# EAGLE schematic CPU board 2 7 (EAGLE 9.3.1)
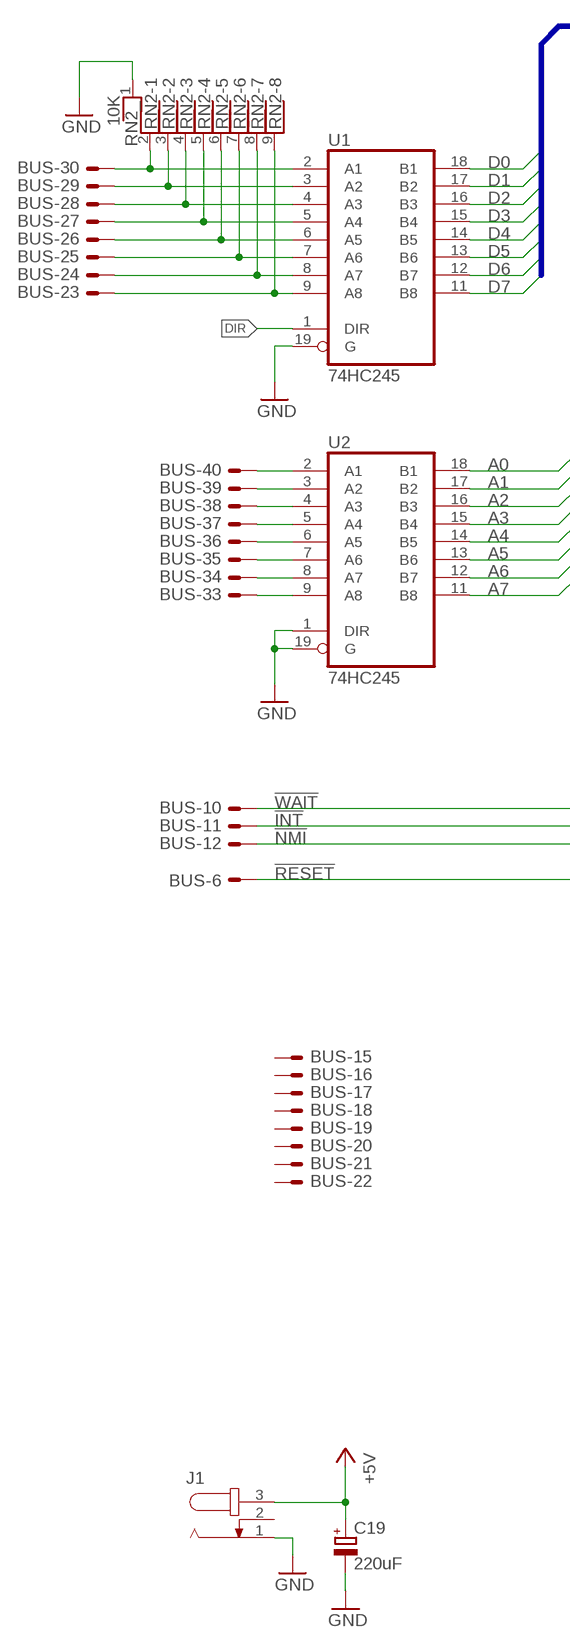
[diagram p0: schematic, sheet 1, part 1 of 2]
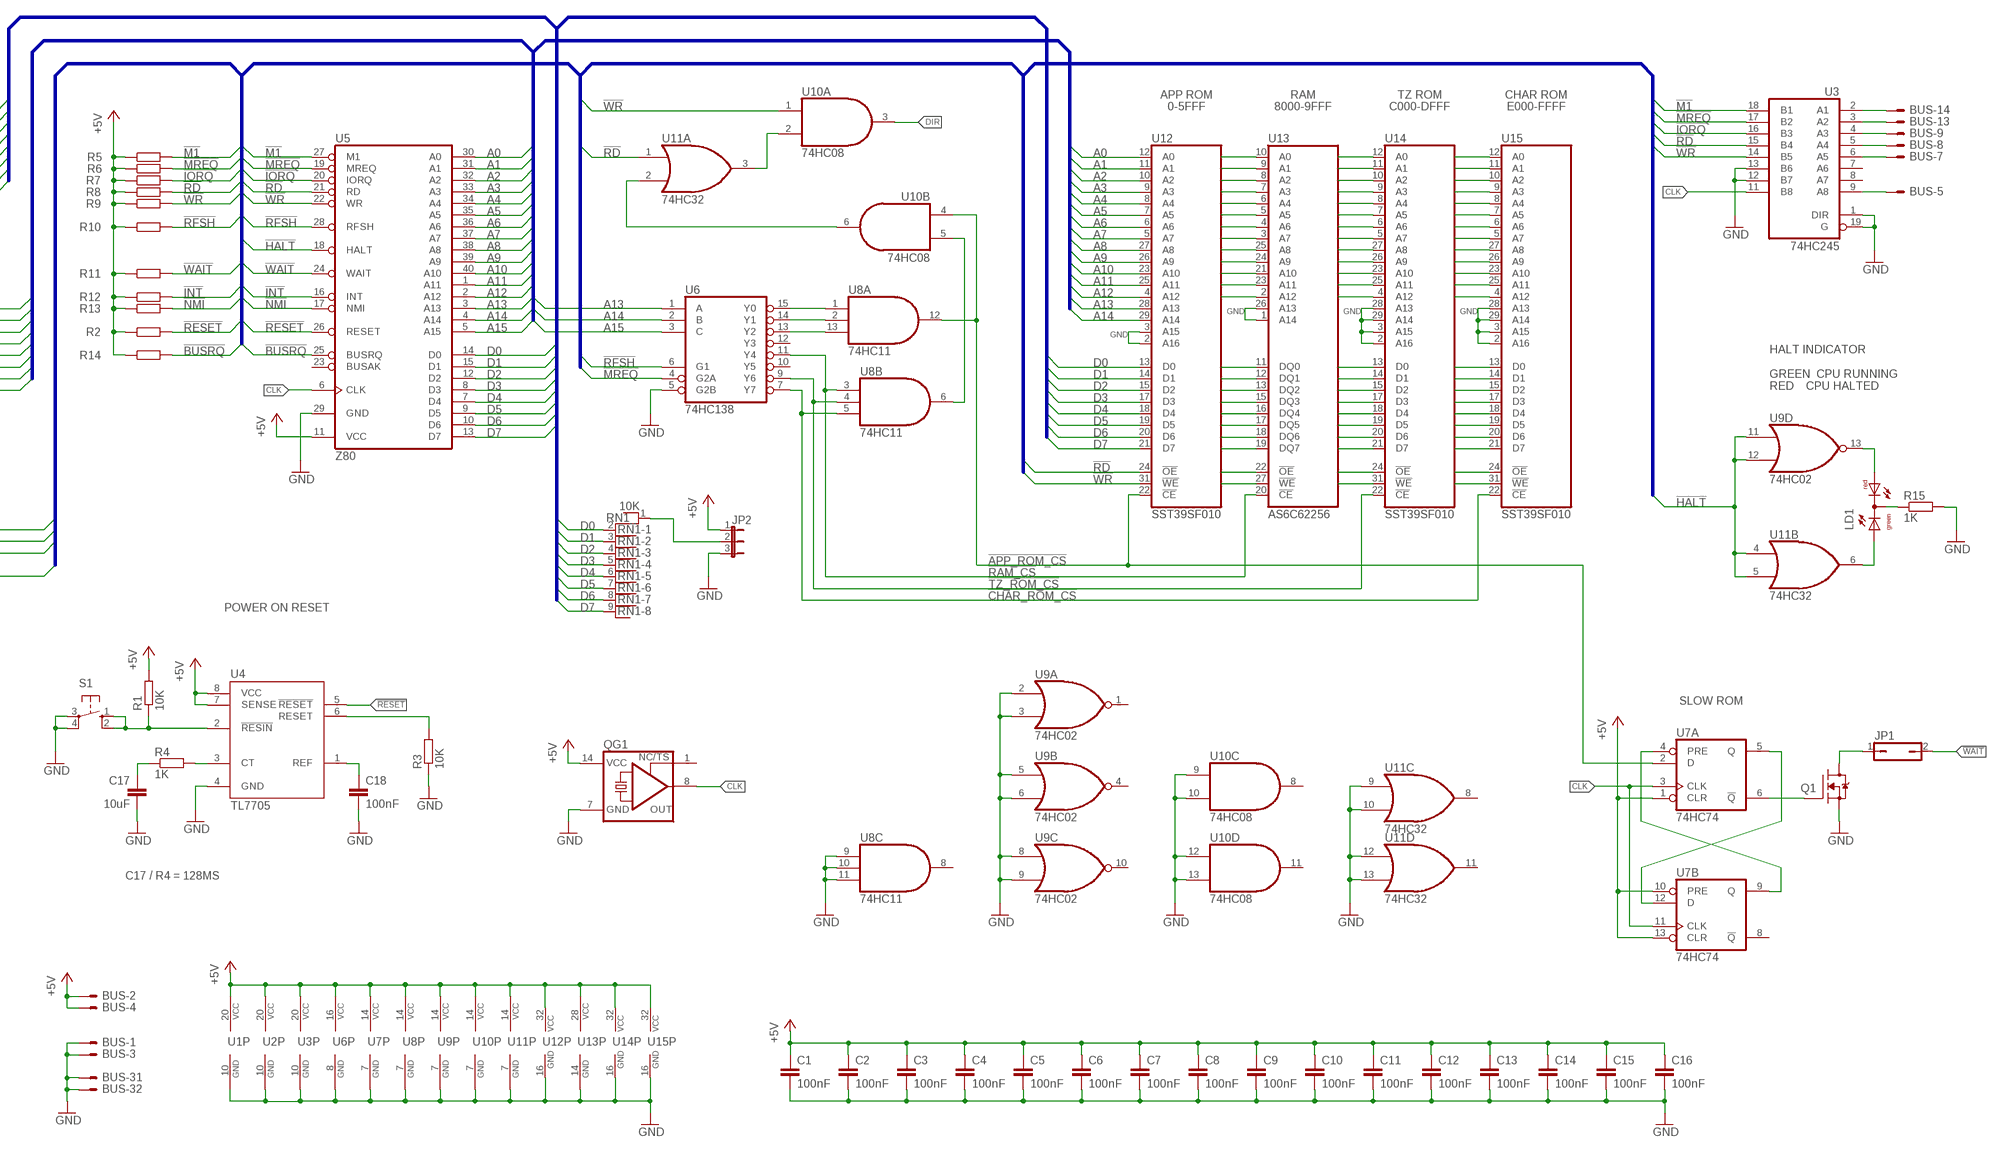
[diagram p1: schematic, sheet 1, part 2 of 2]

## Parts
BUS  ML40E  [ML40]
C1  100nF  C-EU050-025X075  [C050-025X075]
C2  100nF  C-EU050-025X075  [C050-025X075]
C3  100nF  C-EU050-025X075  [C050-025X075]
C4  100nF  C-EU050-025X075  [C050-025X075]
C5  100nF  C-EU050-025X075  [C050-025X075]
C6  100nF  C-EU050-025X075  [C050-025X075]
C7  100nF  C-EU050-025X075  [C050-025X075]
C8  100nF  C-EU050-025X075  [C050-025X075]
C9  100nF  C-EU050-025X075  [C050-025X075]
C10  100nF  C-EU050-025X075  [C050-025X075]
C11  100nF  C-EU050-025X075  [C050-025X075]
C12  100nF  C-EU050-025X075  [C050-025X075]
C13  100nF  C-EU050-025X075  [C050-025X075]
C14  100nF  C-EU050-025X075  [C050-025X075]
C15  100nF  C-EU050-025X075  [C050-025X075]
C16  100nF  C-EU050-025X075  [C050-025X075]
C17  10uF  C-EU050-025X075  [C050-025X075]
C18  100nF  C-EU050-025X075  [C050-025X075]
C19  220uF  CPOL-EUE3.5-8  [E3,5-8]
J1  JACK-PLUG0  [SPC4077]
JP1  JP1Q  [JP1]
JP2  JP2E  [JP2]
LD1  DUOLED-RG-C  [DUOLED-C-5MM]
Q1  2N7000  [TO-92-FORMED]
QG1  XO-14  [DIL14S]
R1  10K  R-EU_0207/10  [0207/10]
R2  10K  R-EU_0207/10  [0207/10]
R3  10K  R-EU_0207/10  [0207/10]
R4  1K  R-EU_0207/10  [0207/10]
R5  R-EU_0207/10  [0207/10]
R6  R-EU_0207/10  [0207/10]
R7  R-EU_0207/10  [0207/10]
R8  R-EU_0207/10  [0207/10]
R9  R-EU_0207/10  [0207/10]
R10  R-EU_0207/10  [0207/10]
R11  R-EU_0207/10  [0207/10]
R12  R-EU_0207/10  [0207/10]
R13  R-EU_0207/10  [0207/10]
R14  R-EU_0207/10  [0207/10]
R15  1K  R-EU_0207/10  [0207/10]
RN1  10K  RNX8  [RN-9]
RN2  10K  RNX8  [RN-9]
S1  10-XX  [B3F-10XX]
U1  74HC245  74LS245N  [DIL20]
U2  74HC245  74LS245N  [DIL20]
U3  74HC245  74LS245N  [DIL20]
U4  TL7705  TL77XXA  [DIL08]
U5  Z80  Z80CPU  [DIL40]
U6  74HC138  74LS138N  [DIL16]
U7  74HC74  74LS74N  [DIL14]
U8  74HC11  74LS11N  [DIL14]
U9  74HC02  74LS02N  [DIL14]
U10  74HC08  74LS08N  [DIL14]
U11  74HC32  74LS32N  [DIL14]
U12  SST39SF010  SST39SF010P  [DIL32]
U13  AS6C62256  AS6C62256-55PCN  [DIL28-6]
U14  SST39SF010  SST39SF010NS  [PLCC-SR32]
U15  SST39SF010  SST39SF010NS  [PLCC-SR32]

## Nets
!APP_ROM_CS!: U7.2(A:D) U8.12(A:O) U10.4(B:I0) U12.22(!CE)
!BUSRQ!: R14.2 U5.25(BUSRQ)
!CHAR_ROM_CS!: U6.7(Y7) U8.5(B:I2) U15.22(!CE)
!HALT!: U5.18(HALT) U9.11(D:I0) U9.12(D:I1) U11.4(B:I0) U11.5(B:I1)
!INT!: BUS.11 R12.2 U5.16(INT)
!IORQ!: R7.2 U3.16(B3) U5.20(IORQ)
!M1!: R5.2 U3.18(B1) U5.27(M1)
!MREQ!: R6.2 U3.17(B2) U5.19(MREQ) U6.4(G2A)
!NMI!: BUS.12 R13.2 U5.17(NMI)
!RAM_CS!: U6.11(Y4) U8.3(B:I0) U13.20(!CE)
!RD!: R8.2 U3.15(B4) U5.21(RD) U11.1(A:I0) U12.24(!OE) U13.22(!OE) U14.24(!OE) U15.24(!OE)
!RESET!: BUS.6 R2.2 U4.5(!RESET!) U5.26(RESET)
!RFSH!: R10.2 U5.28(RFSH) U6.6(G1)
!TZ_ROM_CS!: U6.9(Y6) U8.4(B:I1) U14.22(!CE)
!WAIT!: BUS.10 JP1.2 R11.2 U5.24(WAIT)
!WR!: R9.2 U3.14(B5) U5.22(WR) U10.1(A:I0) U12.31(!WE) U13.27(!WE) U14.31(!WE) U15.31(!WE)
+5V: BUS.2 BUS.4 C1.1 C2.1 C3.1 C4.1 C5.1 C6.1 C7.1 C8.1 C9.1 C10.1 C11.1 C12.1 C13.1 C14.1 C15.1 C16.1 C19.+ J1.3 JP2.1 QG1.14(VCC) R1.2 R2.1 R5.1 R6.1 R7.1 R8.1 R9.1 R10.1 R11.1 R12.1 R13.1 R14.1 U1.20(VCC) U2.20(VCC) U3.20(VCC) U4.7(SENSE) U4.8(VCC) U5.11(VCC) U6.16(VCC) U7.1(A:CLR) U7.10(B:PRE) U7.13(B:CLR) U7.14(P:VCC) U8.14(P:VCC) U9.14(P:VCC) U10.14(P:VCC) U11.14(P:VCC) U12.32(VCC) U13.28(VCC) U14.32(VCC) U15.32(VCC)
A0: U2.18(B1) U5.30(A0) U12.12(A0) U13.10(A0) U14.12(A0) U15.12(A0)
A1: U2.17(B2) U5.31(A1) U12.11(A1) U13.9(A1) U14.11(A1) U15.11(A1)
A2: U2.16(B3) U5.32(A2) U12.10(A2) U13.8(A2) U14.10(A2) U15.10(A2)
A3: U2.15(B4) U5.33(A3) U12.9(A3) U13.7(A3) U14.9(A3) U15.9(A3)
A4: U2.14(B5) U5.34(A4) U12.8(A4) U13.6(A4) U14.8(A4) U15.8(A4)
A5: U2.13(B6) U5.35(A5) U12.7(A5) U13.5(A5) U14.7(A5) U15.7(A5)
A6: U2.12(B7) U5.36(A6) U12.6(A6) U13.4(A6) U14.6(A6) U15.6(A6)
A7: U2.11(B8) U5.37(A7) U12.5(A7) U13.3(A7) U14.5(A7) U15.5(A7)
A8: U5.38(A8) U12.27(A8) U13.25(A8) U14.27(A8) U15.27(A8)
A9: U5.39(A9) U12.26(A9) U13.24(A9) U14.26(A9) U15.26(A9)
A10: U5.40(A10) U12.23(A10) U13.21(A10) U14.23(A10) U15.23(A10)
A11: U5.1(A11) U12.25(A11) U13.23(A11) U14.25(A11) U15.25(A11)
A12: U5.2(A12) U12.4(A12) U13.2(A12) U14.4(A12) U15.4(A12)
A13: U5.3(A13) U6.1(A) U12.28(A13)
A14: U5.4(A14) U6.2(B) U12.29(A14)
A15: U5.5(A15) U6.3(C)
CLK: QG1.8(OUT) U3.11(B8) U5.6(CLK) U7.3(A:CLK) U7.11(B:CLK)
D0: RN1.2 U1.18(B1) U5.14(D0) U12.13(D0) U13.11(DQ0) U14.13(D0) U15.13(D0)
D1: RN1.3 U1.17(B2) U5.15(D1) U12.14(D1) U13.12(DQ1) U14.14(D1) U15.14(D1)
D2: RN1.4 U1.16(B3) U5.12(D2) U12.15(D2) U13.13(DQ2) U14.15(D2) U15.15(D2)
D3: RN1.5 U1.15(B4) U5.8(D3) U12.17(D3) U13.15(DQ3) U14.17(D3) U15.17(D3)
D4: RN1.6 U1.14(B5) U5.7(D4) U12.18(D4) U13.16(DQ4) U14.18(D4) U15.18(D4)
D5: RN1.7 U1.13(B6) U5.9(D5) U12.19(D5) U13.17(DQ5) U14.19(D5) U15.19(D5)
D6: RN1.8 U1.12(B7) U5.10(D6) U12.20(D6) U13.18(DQ6) U14.20(D6) U15.20(D6)
D7: RN1.9 U1.11(B8) U5.13(D7) U12.21(D7) U13.19(DQ7) U14.21(D7) U15.21(D7)
DIR: U1.1(DIR) U10.3(A:O)
GND: BUS.1 BUS.3 BUS.31 BUS.32 C1.2 C2.2 C3.2 C4.2 C5.2 C6.2 C7.2 C8.2 C9.2 C10.2 C11.2 C12.2 C13.2 C14.2 C15.2 C16.2 C17.2 C18.2 C19.- J1.1 JP2.3 Q1.1(S) QG1.7(GND) R3.1 R15.2 RN2.1 S1.3(P) S1.4(P1) U1.10(GND) U1.19(G) U2.1(DIR) U2.10(GND) U2.19(G) U3.1(DIR) U3.10(GND) U3.12(B7) U3.13(B6) U3.19(G) U4.4(GND) U5.29(GND) U6.5(G2B) U6.8(GND) U7.7(P:GND) U8.7(P:GND) U8.9(C:I0) U8.10(C:I1) U8.11(C:I2) U9.2(A:I0) U9.3(A:I1) U9.5(B:I0) U9.6(B:I1) U9.7(P:GND) U9.8(C:I0) U9.9(C:I1) U10.7(P:GND) U10.9(C:I0) U10.10(C:I1) U10.12(D:I0) U10.13(D:I1) U11.7(P:GND) U11.9(C:I0) U11.10(C:I1) U11.12(D:I0) U11.13(D:I1) U12.2(A16) U12.3(A15) U12.16(GND) U13.1(A14) U13.14(GND) U13.26(A13) U14.2(A16) U14.3(A15) U14.16(GND) U14.28(A13) U14.29(A14) U15.2(A16) U15.3(A15) U15.16(GND) U15.28(A13) U15.29(A14)
N$1: R3.2 U4.6(RESET)
N$2: R1.1 S1.1(S) S1.2(S1) U4.2(!RESIN!)
N$3: R4.2 U4.3(CT)
N$4: C17.1 R4.1
N$5: C18.1 U4.1(REF)
N$6: U6.15(Y0) U8.1(A:I0)
N$7: U7.5(A:Q) U7.12(B:D)
N$8: U7.4(A:PRE) U7.9(B:Q)
N$9: BUS.33 U2.9(A8)
N$10: BUS.34 U2.8(A7)
N$11: JP1.1 Q1.3(D)
N$12: U6.14(Y1) U8.2(A:I1)
N$13: U6.13(Y2) U8.13(A:I2)
N$14: JP2.2 RN1.1
N$15: BUS.35 U2.7(A6)
N$16: BUS.36 U2.6(A5)
N$17: BUS.37 U2.5(A4)
N$18: BUS.38 U2.4(A3)
N$19: U8.6(B:O) U10.5(B:I1)
N$20: U10.6(B:O) U11.2(A:I1)
N$21: U10.2(A:I1) U11.3(A:O)
N$22: BUS.39 U2.3(A2)
N$23: Q1.2(G) U7.6(A:!Q)
N$24: BUS.40 U2.2(A1)
N$25: BUS.23 RN2.9 U1.9(A8)
N$26: BUS.24 RN2.8 U1.8(A7)
N$27: BUS.25 RN2.7 U1.7(A6)
N$28: BUS.26 RN2.6 U1.6(A5)
N$29: BUS.27 RN2.5 U1.5(A4)
N$30: BUS.28 RN2.4 U1.4(A3)
N$31: BUS.29 RN2.3 U1.3(A2)
N$32: BUS.30 RN2.2 U1.2(A1)
N$33: BUS.5 U3.9(A8)
N$35: BUS.7 U3.6(A5)
N$36: BUS.8 U3.5(A4)
N$37: BUS.9 U3.4(A3)
N$38: BUS.13 U3.3(A2)
N$39: BUS.14 U3.2(A1)
N$41: LD1.AR U9.13(D:O)
N$42: LD1.C R15.1
N$44: LD1.AX(AG) U11.6(B:O)
Unconnected: BUS.15 BUS.16 BUS.17 BUS.18 BUS.19 BUS.20 BUS.21 BUS.22 J1.2 QG1.1(TS) U3.7(A6) U3.8(A7) U5.23(BUSAK) U6.10(Y5) U6.12(Y3) U7.8(B:!Q) U8.8(C:O) U9.1(A:O) U9.4(B:O) U9.10(C:O) U10.8(C:O) U10.11(D:O) U11.8(C:O) U11.11(D:O)

## Buses
Z80DATA:D[0..7]
Z80ADDRESS:A[0..15]
Z80CONTROL:!BUSAK!,!BUSRQ!,!HALT!,!INT!,!IORQ!,!M1!,!MREQ!,!NMI!,!RD!,!RESET!,!RFSH!,!WAIT!,!WR!

## Notes on the sheet
- APP ROM | RAM | TZ ROM | CHAR ROM
- 0-5FFF | 8000-9FFF | C000-DFFF | E000-FFFF
- HALT INDICATOR
  
  GREEN  CPU RUNNING
  RED    CPU HALTED
- POWER ON RESET
- SLOW ROM
- C17 / R4 = 128MS

## Library data of the parts
BUS = con-ml:ML40E: HARTING; OC_FARNELL: unknown; OC_NEWARK: unknown
C1-C18 = rcl:C-EU: CAPACITOR, European symbol
C19 = rcl:CPOL-EU: POLARIZED CAPACITOR, European symbol
J1 = con-jack:JACK-PLUG: DC POWER JACK Power Jack, DC, Right Angle, Through Hole, Rated 5A at 16VDC, PC Terminals Distributor: Farnell (www.Farnell.de) Drawing: 84N1161.pdf / 84N1162.pdf Manufacturer: SPC Technology (www.spctechnology.com) Type: SPC4077 / SPC 4078; OC_FARNELL: unknown; OC_NEWARK: unknown
JP1 = jumper:JP1Q: JUMPER
JP2 = jumper:JP2E: JUMPER
LD1 = led:DUOLED-RG-C: DUO LED 2 colors (red/green), 5 mm, round, common Cathode www.ligitek.com or other producers.
Q1 = Toms Library:2N7000: N channel MOSFET
QG1 = crystal:XO-: CRYSTAL; OC_FARNELL: unknown; OC_NEWARK: unknown
R1-R15 = rcl:R-EU_: RESISTOR, European symbol
RN1 RN2 = resistor-net:RNX8: RESISTOR NETWORK; OC_FARNELL: unknown; OC_NEWARK: unknown
S1 = switch-omron:10-XX: OMRON SWITCH; MPN: B3F-1000; OC_FARNELL: 176432; OC_NEWARK: 36M3542
U1-U3 = 74xx-us:74*245: Octal BUS TRANSCEIVER, 3-state
U4 = Z80:TL77XXA
U5 = zilog:Z80CPU: Z80 FAMILY DEVICE
U6 = 74xx-us:74*138: 3-line to 8-line DECODER/DEMULTIPLEXER
U7 = 74xx-us:74*74: Dual D type positive edge triggered FLIP FLOP, preset and clear
U8 = 74xx-us:74*11: Triple 3-input AND gate
U9 = 74xx-us:74*02: Quad 2-input NOR gate
U10 = 74xx-us:74*08: Quad 2-input AND gate
U11 = 74xx-us:74*32: Quad 2-input OR gate
U12 U14 U15 = Z80 clock:SST39SF010: 1 Mbit x8 Multi-Purpose Flash Source: http://www.sst.com/dotAsset/40782.pdf
U13 = Z80 clock:AS6C62256-55